# EAGLE design Lagopus_A_2 (EAGLE 9.5.2)
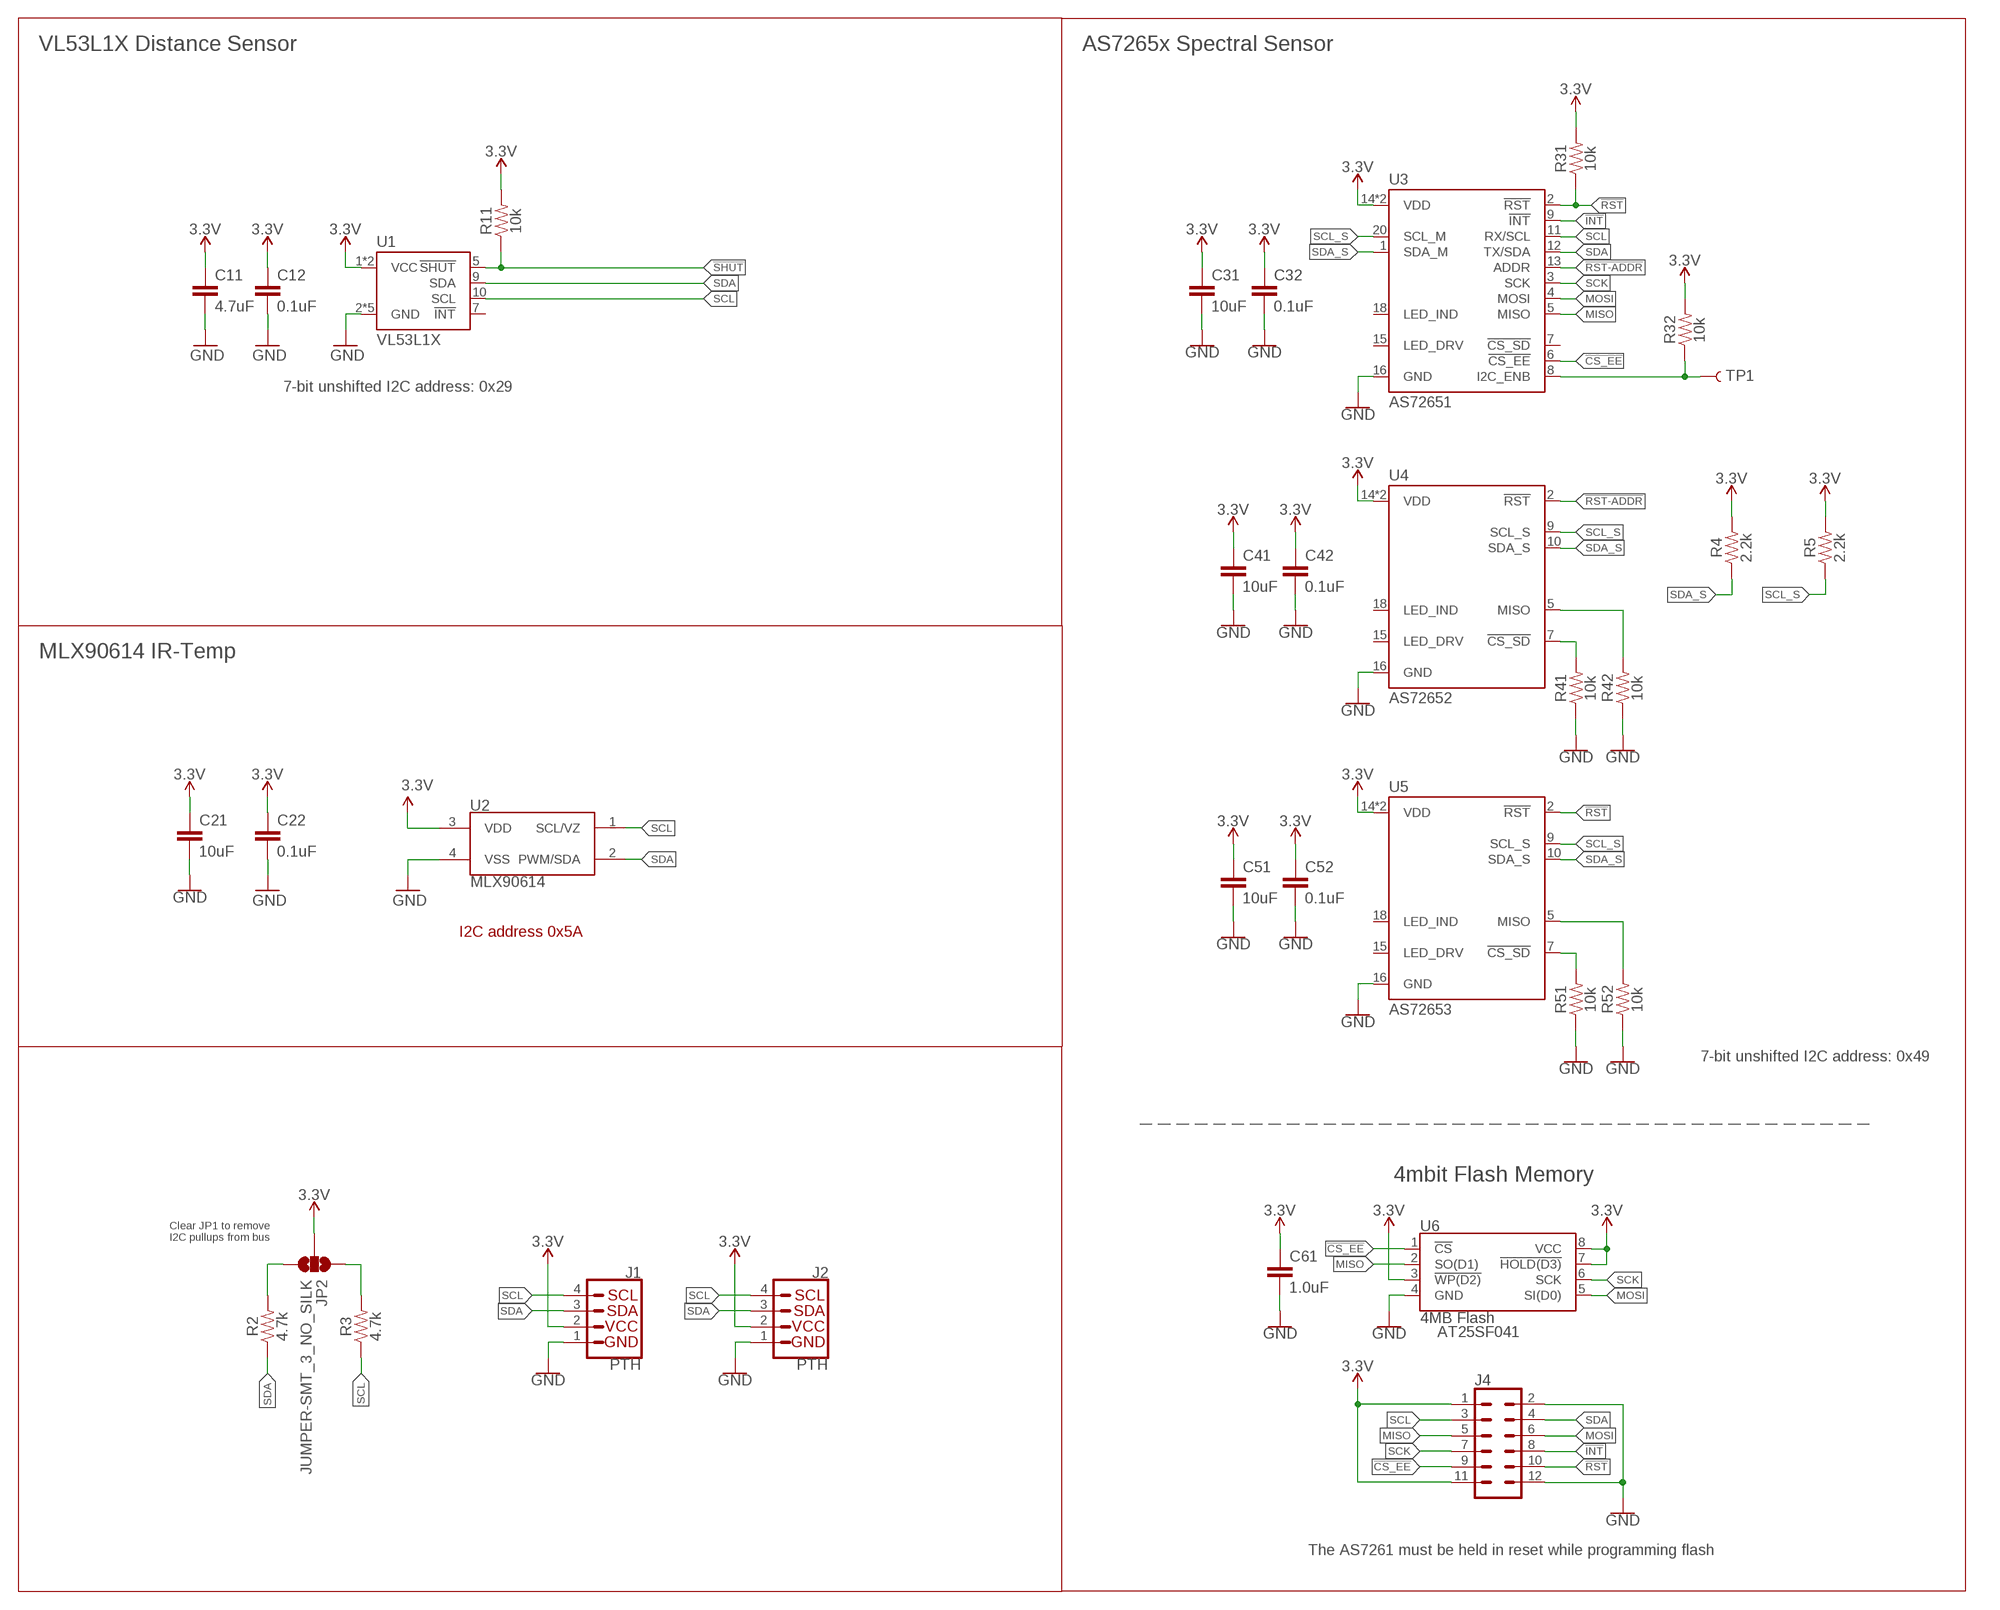
[diagram p0: schematic, sheet 1]

## Parts
C11  4.7uF  4.7UF0603  [0603]
C12  0.1uF  0.1UF-0603-25V-(+80/-20%)  [0603]
C21  10uF  10UF-0603-6.3V-20%  [0603]
C22  0.1uF  0.1UF-0603-25V-(+80/-20%)  [0603]
C31  10uF  10UF-0603-6.3V-20%  [0603]
C32  0.1uF  0.1UF-0603-25V-(+80/-20%)  [0603]
C41  10uF  10UF-0603-6.3V-20%  [0603]
C42  0.1uF  0.1UF-0603-25V-(+80/-20%)  [0603]
C51  10uF  10UF-0603-6.3V-20%  [0603]
C52  0.1uF  0.1UF-0603-25V-(+80/-20%)  [0603]
C61  1.0uF  1.0UF-0603-16V-10%  [0603]
J1  PTH  I2C_STANDARD_NO_SILK  [1X04_NO_SILK]
J2  PTH  I2C_STANDARD_NO_SILK  [1X04_NO_SILK]
J4  CONN_06X2SMD_FEMALE  [2X6_SMD]
JP2  JUMPER-SMT_3_NO_SILK  [SMT-JUMPER_3_NO_SILK]
R2  4.7k  4.7KOHM-0603-1/10W-1%  [0603]
R3  4.7k  4.7KOHM-0603-1/10W-1%  [0603]
R4  2.2k  2.2KOHM-0603-1/10W-1%  [0603]
R5  2.2k  2.2KOHM-0603-1/10W-1%  [0603]
R11  10k  10KOHM-0603-1/10W-1%  [0603]
R31  10k  10KOHM-0603-1/10W-1%  [0603]
R32  10k  10KOHM-0603-1/10W-1%  [0603]
R41  10k  10KOHM-0603-1/10W-1%  [0603]
R42  10k  10KOHM-0603-1/10W-1%  [0603]
R51  10k  10KOHM-0603-1/10W-1%  [0603]
R52  10k  10KOHM-0603-1/10W-1%  [0603]
TP1  TEST-POINT3  [PAD.03X.03]
U1  VL53L1X  VL53L1XSMD  [VL53L1X]
U2  MLX90614  [TO-39]
U3  AS72651  [LGA20]
U4  AS72652  [LGA20]
U5  AS72653  [LGA20]
U6  4MB Flash  AT25SF041  [SO08]

## Nets
3.3V: C11.1 C12.1 C21.1 C22.1 C31.1 C32.1 C41.1 C42.1 C51.1 C52.1 C61.1 J1.2(VCC) J2.2(VCC) J4.1 J4.11 JP2.2 R4.2 R5.2 R11.2 R31.2 R32.2 U1.1(VCC) U1.11(VCC) U2.3(VDD) U3.14(VDD) U3.17(VDD) U4.14(VDD) U4.17(VDD) U5.14(VDD) U5.17(VDD) U6.3(!WP(D2)) U6.7(!HOLD(D3)) U6.8(VCC)
!CS_EE: J4.9 U3.6(!CS_EE) U6.1(!CS)
!INT: J4.8 U3.9(!INT)
!RST: J4.10 R31.1 U3.2(!RST) U5.2(!RST)
!RST-ADDR: U3.13(ADDR) U4.2(!RST)
!SHUT: R11.1 U1.5(!SHUT)
GND: C11.2 C12.2 C21.2 C22.2 C31.2 C32.2 C41.2 C42.2 C51.2 C52.2 C61.2 J1.1(GND) J2.1(GND) J4.2 J4.12 R41.1 R42.1 R51.1 R52.1 U1.2(GND) U1.3(GND) U1.4(GND) U1.6(GND) U1.12(GND) U2.4(VSS) U3.16(GND) U4.16(GND) U5.16(GND) U6.4(GND)
I2C_ENB: R32.1 TP1.P$1 U3.8(I2C_ENB)
MISO: J4.5 U3.5(MISO) U6.2(SO(D1))
MOSI: J4.6 U3.4(MOSI) U6.5(SI(D0))
N$7: JP2.3 R2.2
N$8: JP2.1 R3.2
N$9: R41.2 U4.7(!CS_SD)
N$10: R42.2 U4.5(MISO)
N$12: R51.2 U5.7(!CS_SD)
N$13: R52.2 U5.5(MISO)
SCK: J4.7 U3.3(SCK) U6.6(SCK)
SCL: J1.4(SCL) J2.4(SCL) J4.3 R3.1 U1.10(SCL) U2.1(SCL/VZ) U3.11(RX/SCL)
SCL_S: R5.1 U3.20(SCL_M) U4.9(SCL_S) U5.9(SCL_S)
SDA: J1.3(SDA) J2.3(SDA) J4.4 R2.1 U1.9(SDA) U2.2(PWM/SDA) U3.12(TX/SDA)
SDA_S: R4.1 U3.1(SDA_M) U4.10(SDA_S) U5.10(SDA_S)
Unconnected: U1.7(!INT) U3.7(!CS_SD) U3.15(LED_DRV) U3.18(LED_IND) U4.15(LED_DRV) U4.18(LED_IND) U5.15(LED_DRV) U5.18(LED_IND)

## Notes on the sheet
- VL53L1X Distance Sensor | AS7265x Spectral Sensor
- 7-bit unshifted I2C address: 0x29
- MLX90614 IR-Temp
- I2C address 0x5A
- 7-bit unshifted I2C address: 0x49
- 4mbit Flash Memory
- Clear JP1 to remove
  I2C pullups from bus
- AT25SF041
- The AS7261 must be held in reset while programming flash

## Library data of the parts
C11 = SparkFun-Capacitors:4.7UF: 4.7µF ceramic capacitors A capacitor is a passive two-terminal electrical component used to store electrical energy temporarily in an electric field.; PROD_ID: CAP-08280
C12 C22 C32 C42 C52 = SparkFun-Capacitors:0.1UF: 0.1µF ceramic capacitors A capacitor is a passive two-terminal electrical component used to store electrical energy temporarily in an electric field.; PROD_ID: CAP-00810
C21 C31 C41 C51 = SparkFun-Capacitors:10UF: 10.0µF ceramic capacitors A capacitor is a passive two-terminal electrical component used to store electrical energy temporarily in an electric field.; PROD_ID: CAP-11015
C61 = SparkFun-Capacitors:1.0UF: 1µF ceramic capacitors A capacitor is a passive two-terminal electrical component used to store electrical energy temporarily in an electric field.; PROD_ID: CAP-00868
J1 J2 = SparkX:I2C_STANDARD: SparkFun I2C Standard Pinout Header SparkFun has standardized on a pinout for all I2C based sensor breakouts. This pinout allows I2C boards to be plugged directly into the headers on Arduino Uno compatible boards, and to be daisy chained easily. Example SparkFun Products: SparkFun Atmospheric Sensor Breakout - BME280 <https://www.sparkfun.com/products/13676> SparkFun Altitude/Pressure Sensor Breakout - MPL3115A2 <https://www.sparkfun.com/products/11084> SparkFun TOF Range Finder Sensor - VL6180 <https://www.sparkfun.com/products/12785>
J4 = SparkFun-Connectors:CONN_06X2: Multi connection point. Often used as Generic Header-pin footprint for 0.1 inch spaced/style header connections On any of the 0.1 inch spaced packages, you can populate with these: Break Away Headers - Straight <https://www.sparkfun.com/products/116> (PRT-00116) Break Away Male Headers - Right Angle <https://www.sparkfun.com/products/553> (PRT-00553) Female Headers <https://www.sparkfun.com/products/115> (PRT-00115) Break Away Headers - Machine Pin <https://www.sparkfun.com/products/117> (PRT-00117) Break Away Female Headers - Swiss Machine Pin <https://www.sparkfun.com/products/743> (PRT-00743)
JP2 = SparkFun-Jumpers:JUMPER-SMT_3_NO: Normally open jumper This jumper has three pads in close proximity to each other. Apply solder to close the connection(s).
R2 R3 = SparkFun-Resistors:4.7KOHM: 4.7kΩ resistor A resistor is a passive two-terminal electrical component that implements electrical resistance as a circuit element. Resistors act to reduce current flow, and, at the same time, act to lower voltage levels within circuits. - Wikipedia; PROD_ID: RES-07857
R4 R5 = SparkFun-Resistors:2.2KOHM: 2.2kΩ resistor A resistor is a passive two-terminal electrical component that implements electrical resistance as a circuit element. Resistors act to reduce current flow, and, at the same time, act to lower voltage levels within circuits. - Wikipedia; PROD_ID: RES-08272
R11 R31 R32 R41 R42 R51 R52 = SparkFun-Resistors:10KOHM: 10kΩ resistor A resistor is a passive two-terminal electrical component that implements electrical resistance as a circuit element. Resistors act to reduce current flow, and, at the same time, act to lower voltage levels within circuits. - Wikipedia; PROD_ID: RES-00824
TP1 = SparkFun-Connectors:TEST-POINT: SparkFun Test Points Bare copper test points for troubleshooting or In-Circuit-Testing. These are used by our Production team for verifying production board runs using pogo-pins on test beds. SparkFun Products: SparkFun LSM9DS1 Breakout <https://www.sparkfun.com/products/13284> SparkFun PSOC <https://www.sparkfun.com/products/13714> SparkFun Load Cell Amplifier <https://www.sparkfun.com/products/13879>
U1 = SparkFun-Sensors:VL53L1X: STMicroelectronics VL53L1X - 400 cm IR Laser ToF Sensor VL53L1X is a state-of-the-art ToF laser-ranging sensor, enhancing the ST FlightSense product family. It is the fastest miniature ToF sensor currently on the market with accurate ranging up to 4 m and fast ranging frequency (up to 50 Hz). Housed in a miniature and reflowable package, it integrates a single photon avalanche diode (SPAD) receiving array, a 940 nm invisible laser Class 1 emitter, physical infrared filters, and optics to achieve the best ranging performance in various ambient lighting conditions with a range of cover window options.; PROD_ID: IC-13960
U2 = Lagopus_A_2:MLX90614: Melexis MLX90614 Infrared (IR) Thermometer The MLX90614 is a passive infrared (PIR) I2C temperature sensor.It is designed for non-contact temperature sensing. An internal 17-bit ADC and a powerful DSP contribute to the MLX90614’s high accuracy and resolution. It has a huge number of applications including body temperature measurment and movement detection. Datasheet <http://www.sparkfun.com/datasheets/Sensors/Temperature/SEN-09570-datasheet-3901090614M005.pdf> SparkFun Products Infrared Thermometer - MLX90614 <https://www.sparkfun.com/products/9570> (SEN-09570) SparkFun IR Thermometer Evaluation Board - MLX90614 <https://www.sparkfun.com/products/10740> (SEN-10740); PROD_ID: COMP-09719; SF_ID: SEN-09570
U3 = Lagopus_A_2:AS72651; PROD_ID: IC-14127
U4 = Lagopus_A_2:AS72652; PROD_ID: IC-14128
U5 = Lagopus_A_2:AS72653; PROD_ID: IC-14129
U6 = Lagopus_A_2:AT25SF041: AT25SF041 4Mb Serial Flash Memory 104MHz, SPI, 8-SOIC Datasheet <http://www.adestotech.com/wp-content/uploads/DS-AT25SF041_044.pdf> SparkFun Products: SparkFun ESP8266 Thing <https://www.sparkfun.com/products/13231> SparkFun ESP8266 Thing - Dev Board <https://www.sparkfun.com/products/13711>; PROD_ID: IC-12455

## Net classes
1 Power: width 0.305 mm

## Board
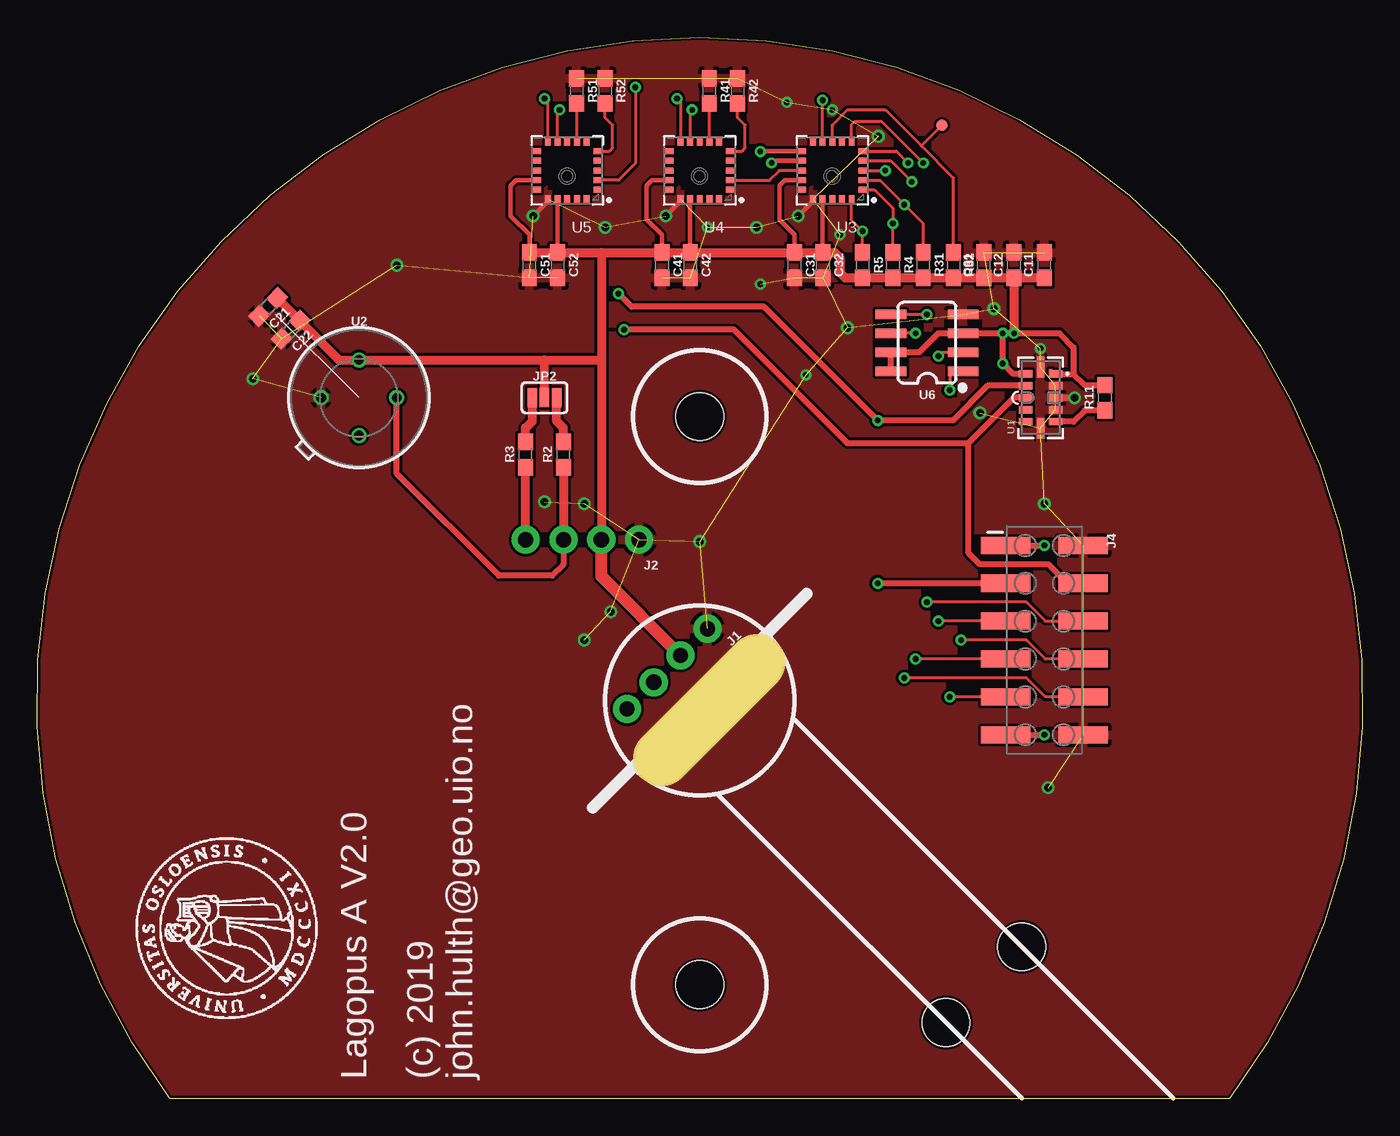
[diagram p1: board, top side]
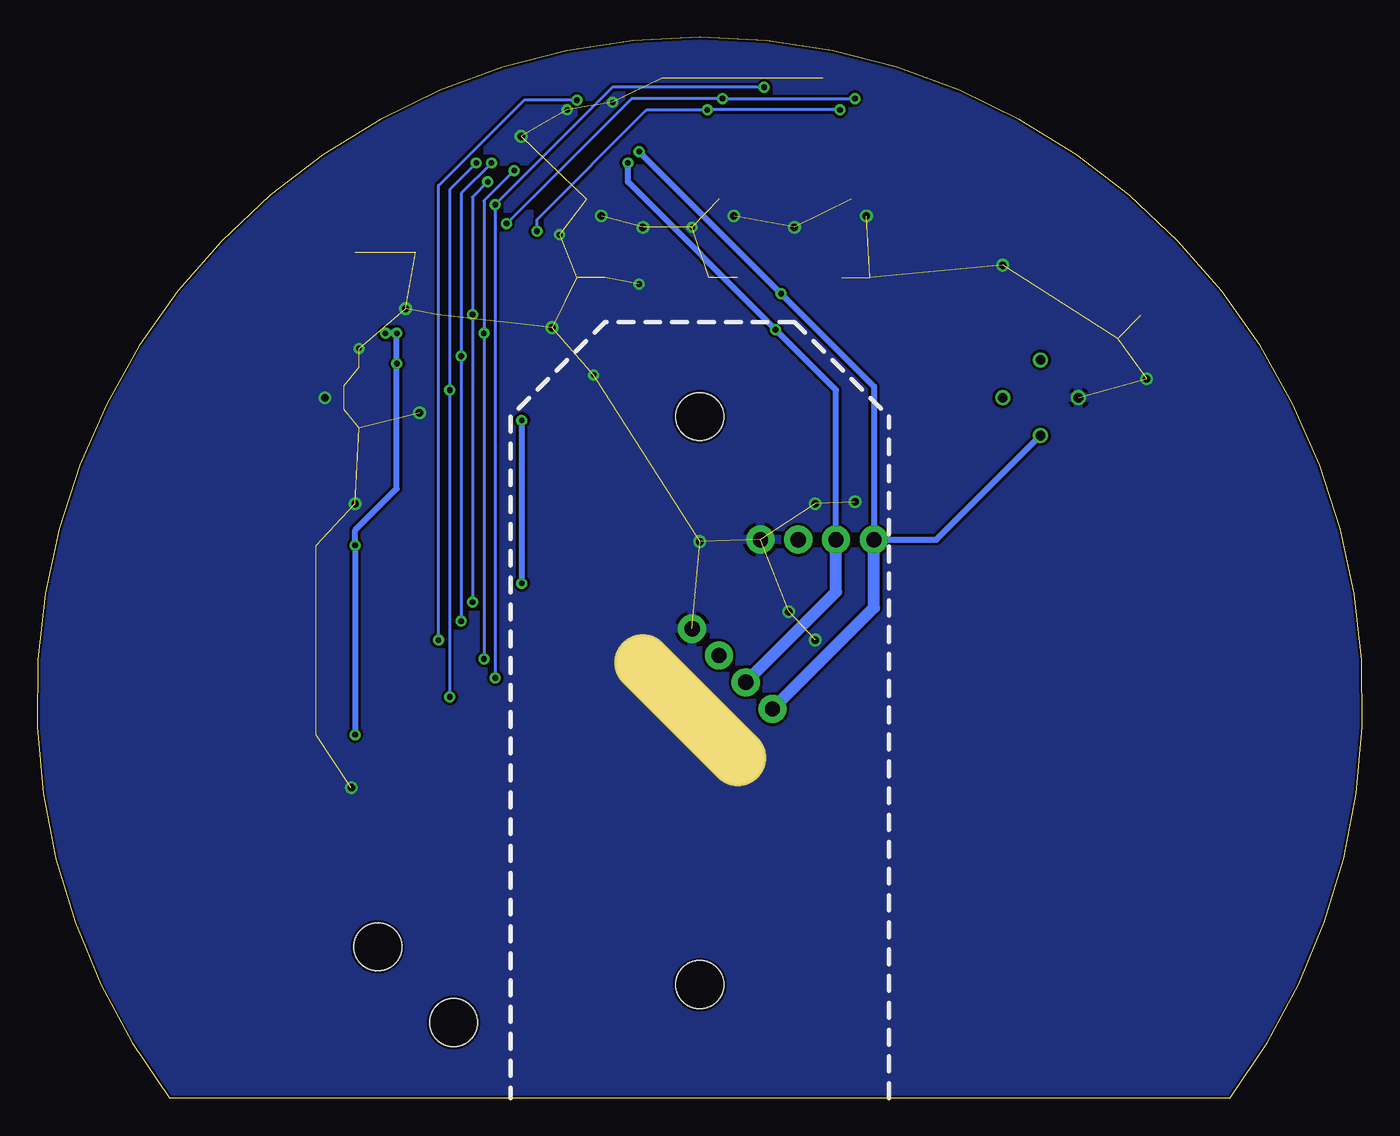
[diagram p2: board, bottom side, seen from below]

Size 88.86 x 71.17 mm. Coordinates in mm from the lower left corner, seen from the top.
Outline: 8.87,0 79.99,0 arc254 8.87,0
Copper layers (1*16): Top 0.035mm / dielectric 1.5mm / Bottom 0.035mm
Design rules "SparkFun-2-layer-TIGHT": minimum track width 7mil, minimum drill 15mil, track to track 7mil, track to pad 7mil, pad to pad 7mil, via to via 7mil, smd to smd 7mil, copper to edge 7mil, drill to drill 7mil, minimum pad ring 7mil, minimum via ring 7mil, stop-mask expansion 4mil, vias tented up to drill 25mil, thermal gap 10mil
Holes 3.2 mm at 44.43,45.72 44.43,7.62 66.02,10.16 60.94,5.08
Milling: 1 lines

### Footprints (pad centres in the part's own frame; a part is rotated, then mirrored left to right if it is on the bottom)
0603 = smd 1.1 x 1: 1 -0.85,0; 2 0.85,0
1X04_NO_SILK = drill 1.016 pad 1.88: 1 0,0; 2 2.54,0; 3 5.08,0; 4 7.62,0
2X6_SMD = smd 1.143 x 3.302: 1 -6.35,-2.603; 2 -6.35,2.603; 3 -3.81,-2.603; 4 -3.81,2.603; 5 -1.27,-2.603; 6 -1.27,2.603; 7 1.27,-2.603; 8 1.27,2.603; 9 3.81,-2.603; 10 3.81,2.603; 11 6.35,-2.603; 12 6.35,2.603
SMT-JUMPER_3_NO_SILK = smd 0.635 x 1.27: 1 -0.813,0; 2 0,0; 3 0.813,0
PAD.03X.03 = smd 0.762 x 0.762: P$1 0,0
VL53L1X = smd 0.5 x 0.9: 1 1.6,-1; 2 0.8,-1; 3 0,-1; 4 -0.8,-1; 5 -1.6,-1; 7 -1.6,1; 8 -0.8,1; 9 0,1; 10 0.8,1; 11 1.6,1 | smd 1.4 x 0.5: 6 -2.05,0; 12 2.05,0
TO-39 = drill 0.65: 1 2.54,0; 2 0,2.54; 3 -2.54,0; 4 0,-2.54
LGA20 = smd 0.55 x 0.4: 1 -2.025,1.3; 2 -2.025,0.65; 3 -2.025,0; 4 -2.025,-0.65; 5 -2.025,-1.3; 11 2.025,-1.3; 12 2.025,-0.65; 13 2.025,0; 14 2.025,0.65; 15 2.025,1.3 | smd 0.4 x 0.55: 6 -1.3,-1.925; 7 -0.65,-1.925; 8 0,-1.925; 9 0.65,-1.925; 10 1.3,-1.925; 16 1.3,1.925; 17 0.65,1.925; 18 0,1.925; 19 -0.65,1.925; 20 -1.3,1.925
SO08 = smd 0.65 x 2.07: 1 -1.905,-2.425; 2 -0.635,-2.425; 3 0.635,-2.425; 4 1.905,-2.425; 5 1.905,2.425; 6 0.635,2.425; 7 -0.635,2.425; 8 -1.905,2.425

### Placement (x,y rotation side)
C11  67.55,55.88 90 top
C12  65.51,55.88 90 top
C21  15.48,53.09 225 top
C22  17,51.56 225 top
C31  50.78,55.88 270 top
C32  52.69,55.88 270 top
C41  41.89,55.88 270 top
C42  43.8,55.88 270 top
C51  33,55.88 270 top
C52  34.91,55.88 270 top
C61  63.48,55.88 90 top
J1  44.94,31.5 225 top
J2  40.37,37.47 180 top
J4  67.55,30.73 270 top
JP2  34.02,46.99 0 top
R2  35.29,43.18 90 top
R3  32.75,43.18 90 top
R4  57.39,55.88 270 top
R5  55.35,55.88 270 top
R11  71.61,46.99 90 top
R31  59.42,55.88 270 top
R32  61.45,55.88 270 top
R41  45.07,67.56 270 top
R42  46.97,67.56 270 top
R51  36.18,67.56 270 top
R52  38.08,67.56 270 top
TP1  60.69,65.28 0 top
U1  67.29,46.99 90 top
U2  21.57,46.99 270 top
U3  53.32,62.23 180 top
U4  44.43,62.23 180 top
U5  35.54,62.23 180 top
U6  59.67,50.67 90 top
U$5  [UIO-LOGO-BL]  19.03,5.08 90 top

### Tracks (layer width: path | path; a pad name or v marks a point on that pad's centre or on a via)
3.3V  (via drill 0.38)
  Top 0.305: U4.17 43.78,56.75 C42.1 | U3.17 52.67,56.75 C32.1 | U5.17 34.89,56.75 C52.1 | C51.1 33,57.91 31.73,59.18 31.73,61.21 32.1,61.58 U5.14 | C41.1 41.89,57.91 40.88,58.93 40.88,61.21 41.24,61.58 U4.14 | C31.1 50.78,57.91 49.77,58.93 49.77,61.21 50.13,61.58 U3.14
  Top 0.406: U1.1 69.5,48.59 | R11.2 70.25,47.84 69.5,48.59 | U6.8 U6.7 59.16,50.04 60.43,51.31 U6.3 v65.51,51.31 | v65.51,51.31 68.56,51.31 69.5,50.37 69.5,48.59 | U1.11 65.44,48.59 v64.75,49.28 v64.75,51.31 v65.51,51.31 | J4.11 v67.55,24.38 | J4.1 v67.55,37.08
  Top 0.61: 34.02,49.53 37.83,49.53 | 37.83,49.53 J2.2 | 37.83,56.73 37.83,49.53 | JP2.2 34.02,49.53 | C51.1 C52.1 37.83,56.73 | 37.83,56.73 C41.1 43.77,56.73 43.78,56.75 | C42.1 C31.1 52.66,56.73 52.67,56.75 | C32.1 53.49,56.73 53.83,56.39 53.83,55.37 54.17,55.03 R5.2 R4.2 R31.2 R32.2 C61.1 C12.1 | C12.1 C11.1 | C12.1 v65.51,51.31 | C21.1 C22.1 20.23,49.53 U2.3 34.02,49.53
  Top 0.813: J1.2 37.83,35.02 J2.2
  Bottom 0.406: v67.55,24.38 v67.55,37.08 67.55,38.1 64.75,40.89 v64.75,49.28 v64.75,51.31 v65.51,51.31
!CS_EE  (via drill 0.38)
  Top 0.203: U3.6 54.62,65.31 54.85,65.53 56.62,65.53 v59.42,62.74 | U6.1 61.33,48.77 61.2,48.63 v61.2,47.5 | J4.9 v61.2,26.92
  Bottom 0.203: v59.42,62.74 61.2,60.96 v61.2,47.5 v61.2,26.92
!INT  (via drill 0.38)
  Top 0.203: U3.9 v52.67,66.94 | v61.96,30.73 66.33,30.73 67.6,29.46 J4.8
  Bottom 0.203: v52.67,66.94 56.23,66.94 61.96,61.21 v61.96,30.73
!RST  (via drill 0.38)
  Top 0.203: U5.2 38.99,61.58 40.11,62.71 v40.11,67.82 | U3.2 56.51,61.58 v58.15,59.94 59.42,58.67 R31.1 | v58.15,28.19 66.33,28.19 67.6,26.92 J4.10
  Bottom 0.203: v40.11,67.82 50.27,67.82 v58.15,59.94 v58.15,28.19
!RST-ADDR
  Top 0.203: U3.13 49.77,62.23 49.12,61.58 U4.2
!SHUT
  Top 0.406: R11.1 70.25,46.14 69.5,45.39 U1.5
GND  (via drill 0.38, 0.5)  (50 unrouted)
  Top 0.305: U3.16 52.02,60.17 v51.04,59.18 | U4.16 43.13,60.17 v42.15,59.18 | U5.16 34.24,60.17 v33.26,59.18
  Top 0.406: U1.3 v69.58,46.99
  other vias: 36.68,39.88 24.11,55.88 63.23,45.97 48.24,58.42 54.34,51.69 38.08,58.42 64.16,52.97 34.02,40.01 36.68,30.73 38.46,32.64 44.43,37.34 14.46,48.26 56.41,64.52 44.94,58.42 51.54,48.51 53.83,57.91 67.29,50.29 48.5,54.61 50.27,66.8 53.32,66.29 67.8,20.83 67.55,39.88
  pour Bottom: -0.02,0 -0.02,73.66 100.31,73.66 100.31,0
  pour Top: -0.02,72.14 -0.02,0 98.79,0 98.79,72.14
I2C_ENB
  Top 0.203: U3.8 53.32,65.28 54.34,66.29 56.88,66.29 59.29,63.88 | TP1.P$1 59.29,63.88 | 59.29,63.88 61.45,61.72 R32.1
MISO  (via drill 0.38)
  Top 0.203: U3.5 57.61,63.53 v58.4,62.74 | v60.43,49.78 60.69,50.04 U6.2 | J4.5 v60.43,32
  Bottom 0.203: v58.4,62.74 60.43,60.71 v60.43,49.78 v60.43,32
MOSI  (via drill 0.38)
  Top 0.203: U3.4 57.24,62.88 v58.66,61.47 | v59.67,33.27 66.33,33.27 67.6,32 J4.6 | v59.67,52.58 U6.5
  Bottom 0.203: v58.66,61.47 59.67,60.45 v59.67,52.58 v59.67,33.27
N$7
  Top 0.61: R2.2 35.29,44.96 34.83,45.42 JP2.3
N$8
  Top 0.61: R3.2 32.75,44.96 33.2,45.42 JP2.1
N$9
  Top 0.203: U4.7 R41.2
N$10
  Top 0.203: U4.5 47.26,63.53 47.48,63.75 47.48,65.28 46.97,65.79 R42.2
N$12
  Top 0.203: U5.7 36.19,66.7 R51.2
N$13
  Top 0.203: U5.5 38.37,63.53 38.59,63.75 38.59,65.28 38.08,65.79 R52.2
SCK  (via drill 0.38)
  Top 0.203: U3.3 v56.88,62.23 | v58.91,51.31 U6.6 | J4.7 v58.91,29.46
  Bottom 0.203: v56.88,62.23 58.91,60.2 v58.91,51.31 v58.91,29.46
SCL  (via drill 0.38)
  Top 0.305: U3.11 48.53,63.53 v48.5,63.5
  Top 0.406: U1.10 63.74,47.79 61.41,45.47 v56.37,45.47 52.77,49.07 48.75,53.09 39.86,53.09 v38.97,53.98 | J4.3 v56.37,34.54
  Top 0.61: J2.4 R3.1
  Bottom 0.406: v48.5,63.5 v38.97,53.98 32.75,47.75 J2.4 28.56,37.47 U2.1 | v56.37,34.54 v56.37,45.47
  Bottom 0.813: J1.4 32.75,32.91 J2.4
SCL_S  (via drill 0.38)
  Top 0.203: U5.9 34.89,66.15 v35.03,66.29 | v43.92,66.29 43.78,66.15 U4.9 | U3.20 54.62,58.9 v55.35,58.17 R5.1
  Bottom 0.203: v35.03,66.29 v43.92,66.29 47.99,66.29 55.35,58.93 v55.35,58.17
SDA  (via drill 0.38)
  Top 0.305: U3.12 49.4,62.88 v49.26,62.74
  Top 0.406: J2.3 35.29,35.81 34.53,35.05 30.97,35.05 24.11,41.91 U2.2 | v39.35,51.56 46.72,51.56 54.34,43.94 62.47,43.94 | U1.9 65.51,46.99 62.47,43.94 | 62.47,43.94 62.47,36.58 63.23,35.81 67.8,35.81 69.07,34.54 J4.4
  Top 0.61: R2.1 J2.3
  Bottom 0.406: J2.3 35.29,47.5 v39.35,51.56 49.26,61.47 v49.26,62.74
  Bottom 0.813: J1.3 35.29,33.96 J2.3
SDA_S  (via drill 0.38)
  Top 0.203: U5.10 34.24,66.83 v34.02,67.06 | v42.91,67.06 43.13,66.83 U4.10 | U3.1 56.15,60.93 57.39,59.69 v57.39,58.67 R4.1
  Bottom 0.203: v34.02,67.06 v42.91,67.06 49,67.06 v57.39,58.67

### Text on the board
tPlace: Lagopus A V2.0 | (c) 2019 / john.hulth@geo.uio.no